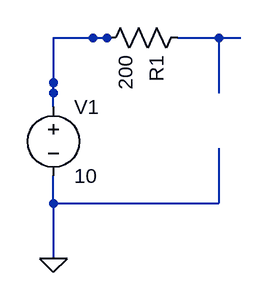
[diagram p0: schematic circuit.asc]
circuit.asc, the LTspice schematic file:
Version 4
SHEET 1 880 680
WIRE 592 320 665 320
WIRE 494 320 510 320
SYMBOL res 608 304 R90
SYMATTR InstName R1
SYMATTR Value 200
FLAG 448 576 0
WIRE 448 400 448 372
WIRE 448 512 448 480
SYMBOL voltage 448 384 R0
SYMATTR InstName V1
SYMATTR Value 10
WIRE 640 320 640 384
WIRE 448 320 448 384
WIRE 448 320 512 320
WIRE 448 512 448 576
WIRE 448 512 512 512
WIRE 640 448 640 512
WIRE 576 512 640 512
WIRE 512 512 576 512

The netlist it stands for:
* circuit.asc
R1 N001 N002 200
V1 N002 0 10
.backanno
.end